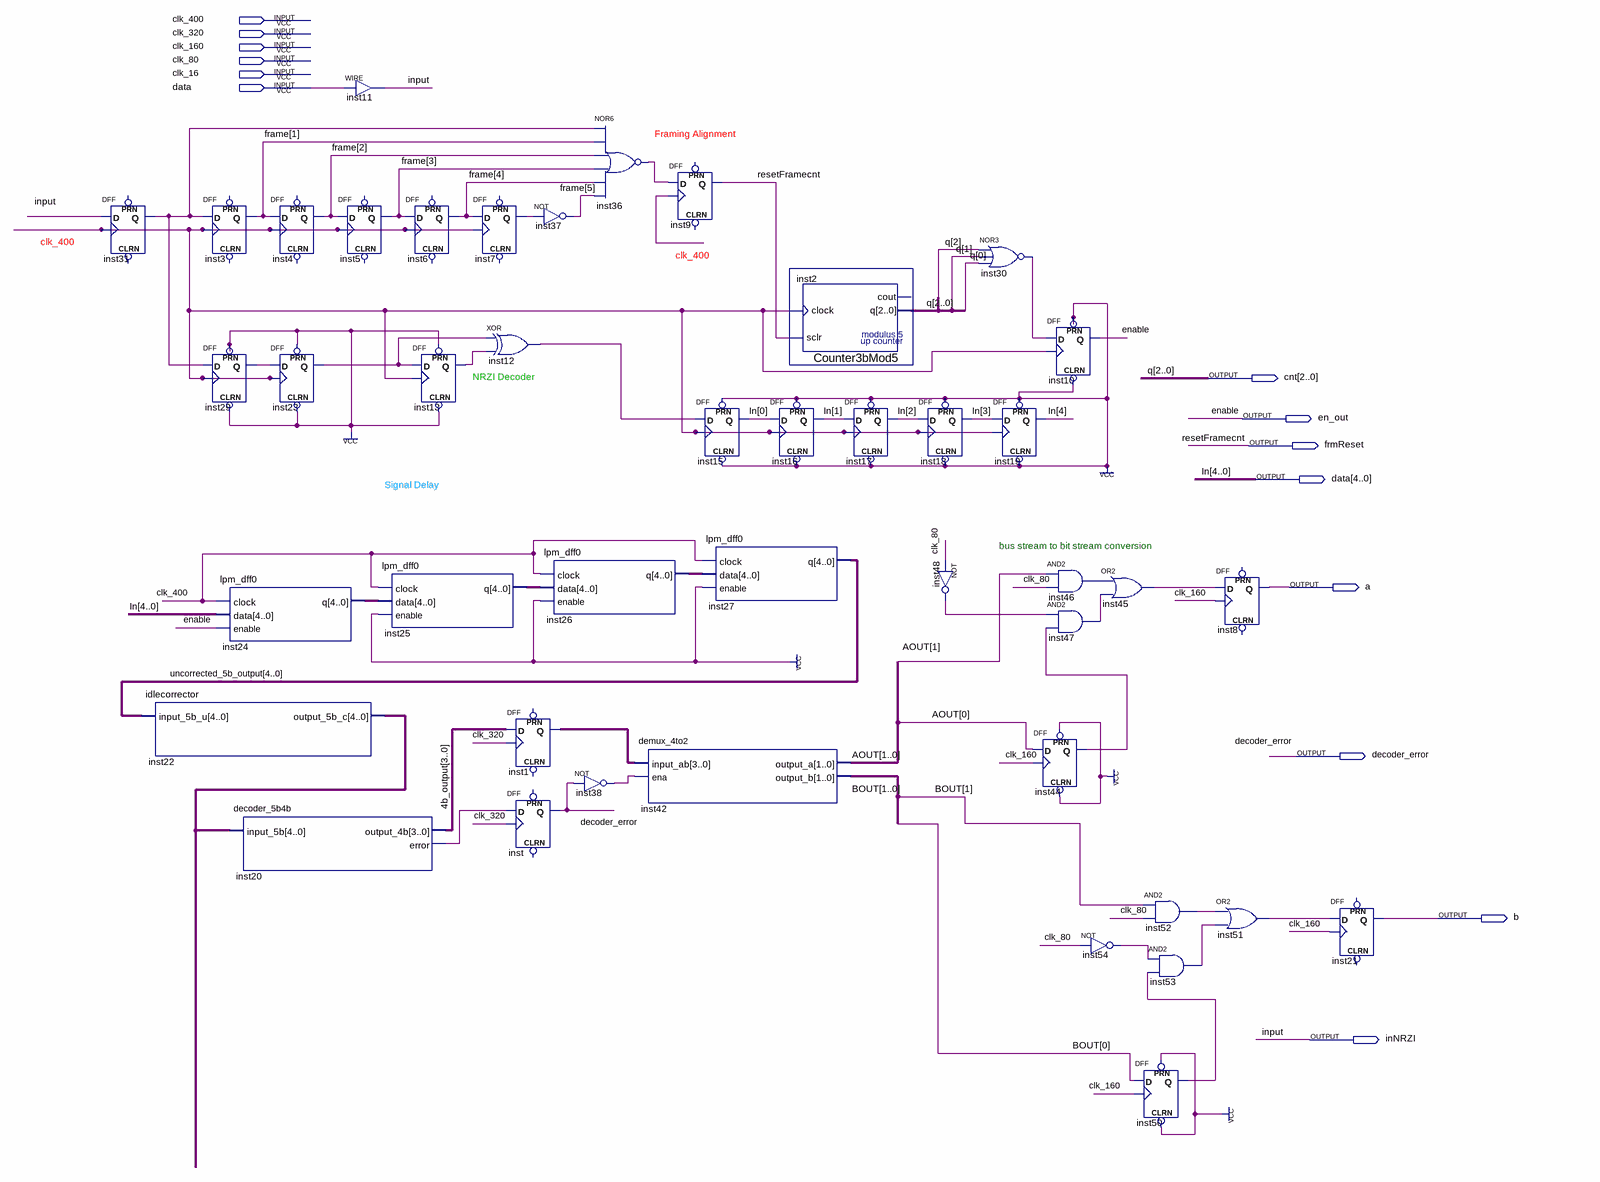
[diagram p0: schematic sheet]
// Quartus schematic decoder_yi.bdf as structural Verilog: 44 symbols, 14 pins
module decoder_yi (
  input  clk_400,
  input  clk_320,
  input  clk_160,
  input  clk_80,
  input  clk_16,
  input  data_1bit,
  output [2:0] cnt,
  output en_out,
  output frmReset,
  output [4:0] data,
  output a,
  output decoder_error,
  output b,
  output inNRZI
);

  wire inst7_q, inst12_out, inst13_q, inst20_error, inst23_q, inst29_q, inst30_out, inst31_q, inst36_out,
       inst38_out, inst44_q, inst45_out, inst46_out, inst47_out, inst48_out, inst50_q, inst51_out,
       inst52_out, inst53_out, inst54_out;
  wire [1:0] AOUT, BOUT;
  wire [3:0] \4b_output , inst1_q;
  wire [4:0] inst22_output_5b_c, inst24_q, inst25_q, inst26_q, uncorrected_5b_output;
  wire [5:1] frame;

  DFF inst31 (.CLK(clk_400), .D(inNRZI), .Q(inst31_q));  // open: CLRN, PRN
  idlecorrector inst22 (.input_5b_u(uncorrected_5b_output), .output_5b_c(inst22_output_5b_c));
  DFF inst3 (.CLK(clk_400), .D(inst31_q), .Q(frame[1]));  // open: CLRN, PRN
  DFF inst29 (.CLRN(1'b1), .CLK(clk_400), .D(inst31_q), .PRN(1'b1), .Q(inst29_q));
  lpm_dff0 inst24 (.clock(clk_400), .data(data), .enable(en_out), .q(inst24_q));
  decoder_5b4b inst20 (.input_5b(inst22_output_5b_c), .output_4b(\4b_output ), .error(inst20_error));
  DFF inst4 (.CLK(clk_400), .D(frame[1]), .Q(frame[2]));  // open: CLRN, PRN
  DFF inst23 (.CLRN(1'b1), .CLK(clk_400), .D(inst29_q), .PRN(1'b1), .Q(inst23_q));
  assign inNRZI = data_1bit;  // WIRE inst11
  DFF inst5 (.CLK(clk_400), .D(frame[2]), .Q(frame[3]));  // open: CLRN, PRN
  DFF inst6 (.CLK(clk_400), .D(frame[3]), .Q(frame[4]));  // open: CLRN, PRN
  DFF inst13 (.CLRN(1'b1), .CLK(clk_400), .D(inst23_q), .PRN(1'b1), .Q(inst13_q));
  lpm_dff0 inst25 (.clock(clk_400), .data(inst24_q), .enable(1'b1), .q(inst25_q));
  DFF inst7 (.CLK(clk_400), .D(frame[4]), .Q(inst7_q));  // open: CLRN, PRN
  xor inst12 (inst12_out, inst23_q, inst13_q);
  DFF inst1[3:0] (.CLK(clk_320), .D(\4b_output ), .Q(inst1_q));  // open: CLRN, PRN
  DFF inst (.CLK(clk_320), .D(inst20_error), .Q(decoder_error));  // open: CLRN, PRN
  not inst37 (frame[5], inst7_q);
  lpm_dff0 inst26 (.clock(clk_400), .data(inst25_q), .enable(1'b1), .q(inst26_q));
  not inst38 (inst38_out, decoder_error);
  nor inst36 (inst36_out, inst31_q, frame[1], frame[2], frame[3], frame[4], frame[5]);
  DFF inst9 (.CLK(clk_400), .D(inst36_out), .Q(frmReset));  // open: CLRN, PRN
  demux_4to2 inst42 (.input_ab(inst1_q), .ena(inst38_out), .output_a(AOUT), .output_b(BOUT));
  DFF inst15 (.CLRN(1'b1), .CLK(clk_400), .D(inst12_out), .PRN(1'b1), .Q(data[0]));
  lpm_dff0 inst27 (.clock(clk_400), .data(inst26_q), .enable(1'b1), .q(uncorrected_5b_output));
  Counter3bMod5 inst2 (.sclr(frmReset), .clock(clk_400), .q(cnt));  // open: cout
  DFF inst16 (.CLRN(1'b1), .CLK(clk_400), .D(data[0]), .PRN(1'b1), .Q(data[1]));
  DFF inst17 (.CLRN(1'b1), .CLK(clk_400), .D(data[1]), .PRN(1'b1), .Q(data[2]));
  DFF inst18 (.CLRN(1'b1), .CLK(clk_400), .D(data[2]), .PRN(1'b1), .Q(data[3]));
  not inst48 (inst48_out, clk_80);
  nor inst30 (inst30_out, cnt[2], cnt[1], cnt[0]);
  DFF inst19 (.CLRN(1'b1), .CLK(clk_400), .D(data[3]), .PRN(1'b1), .Q(data[4]));
  DFF inst10 (.CLRN(1'b1), .CLK(clk_400), .D(inst30_out), .PRN(1'b1), .Q(en_out));
  and inst46 (inst46_out, AOUT[1], clk_80);
  and inst47 (inst47_out, inst48_out, inst44_q);
  DFF inst44 (.CLRN(1'b1), .CLK(clk_160), .D(AOUT[0]), .PRN(1'b1), .Q(inst44_q));
  or inst45 (inst45_out, inst46_out, inst47_out);
  not inst54 (inst54_out, clk_80);
  and inst52 (inst52_out, BOUT[1], clk_80);
  and inst53 (inst53_out, inst54_out, inst50_q);
  DFF inst50 (.CLRN(1'b1), .CLK(clk_160), .D(BOUT[0]), .PRN(1'b1), .Q(inst50_q));
  DFF inst8 (.CLK(clk_160), .D(inst45_out), .Q(a));  // open: CLRN, PRN
  or inst51 (inst51_out, inst52_out, inst53_out);
  DFF inst21 (.CLK(clk_160), .D(inst51_out), .Q(b));  // open: CLRN, PRN

  // Other names for the same wires on the sheet: enable = en_out; In[4:0] = data; input = inNRZI; q[2:0] = cnt;
  //   resetFramecnt = frmReset

  // Notes on the sheet:
  //   Framing Alignment
  //   NRZI Decoder
  //   Signal Delay
  //   bus stream to bit stream conversion
endmodule
